# EAGLE board 8iPanelLED (EAGLE 6.6.0)
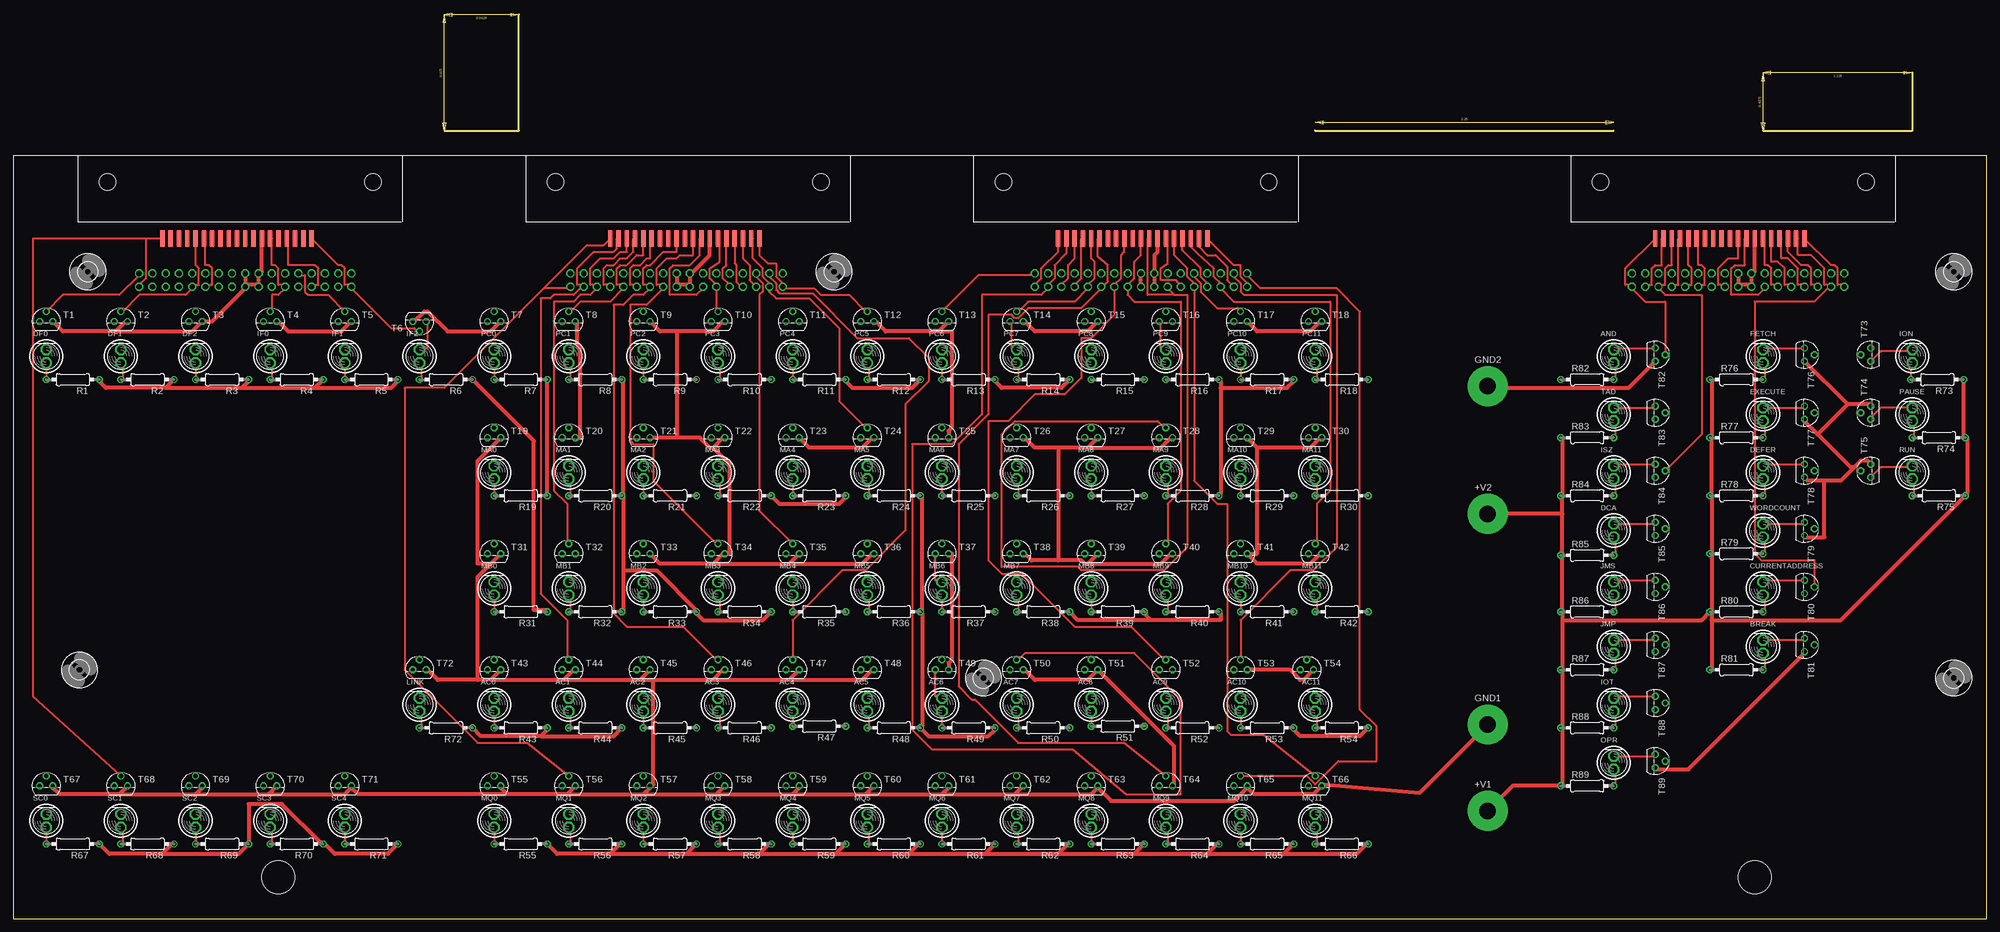
[diagram p2: board, top side]
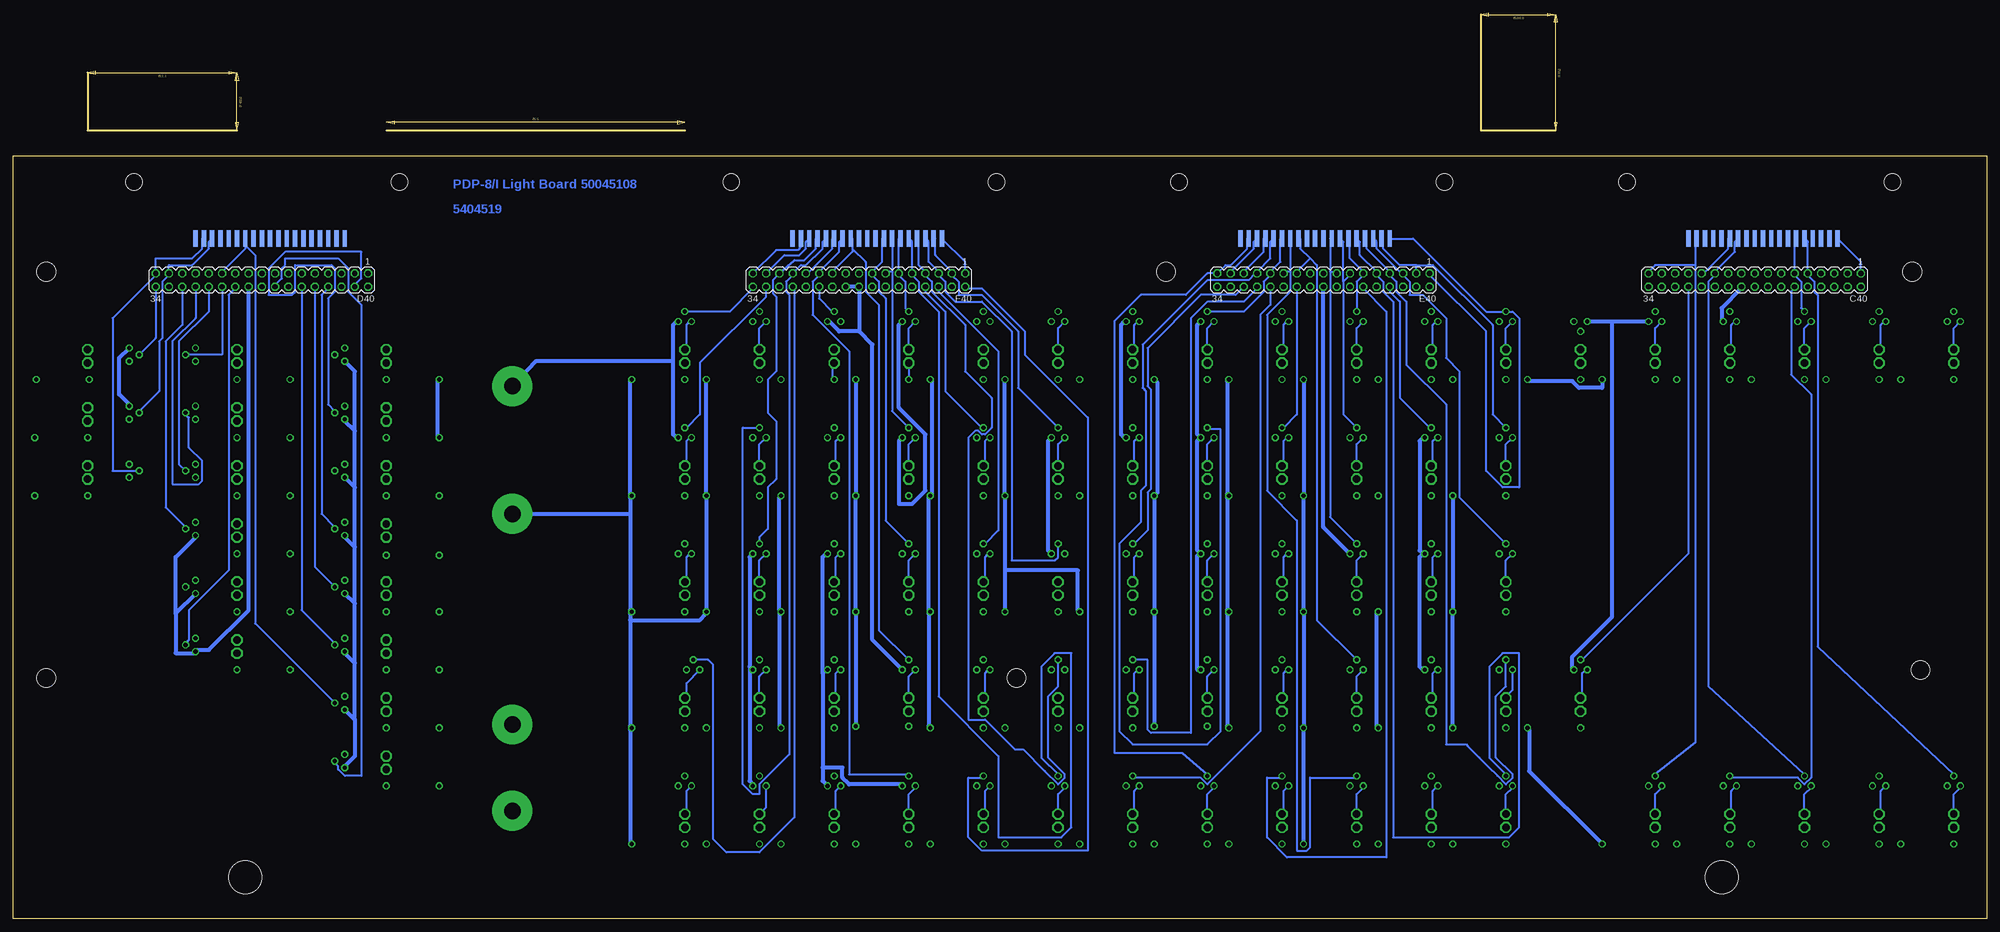
[diagram p3: board, bottom side, seen from below]

Size 377.82 x 173.04 mm. Coordinates in mm from the lower left corner, seen from the top.
Outline: 82.55,150.81 96.84,150.81 96.84,173.04
Outline: 334.96,150.81 363.54,150.81 363.54,161.93
Outline: 249.24,150.81 306.39,150.81
Outline: 0,0 377.82,0 377.82,146.05 0,146.05 0,0
Copper layers (1*16): Top 0.035mm / dielectric 1.5mm / Bottom 0.035mm
Design rules "15mils": minimum track width 15mil, minimum drill 24mil, track to track 15mil, track to pad 10mil, pad to pad 10mil, via to via 10mil, smd to smd 10mil, copper to edge 25mil, drill to drill 10mil, minimum pad ring 10mil, minimum via ring 8mil, stop-mask expansion 0mil, vias tented up to drill 0mil, thermal gap 10mil
Net classes: 1 supply: width 0.762 mm
Holes 6.35 mm at 50.8,7.94 333.38,7.94

## Footprints (pad centres in the part's own frame; a part is rotated, then mirrored left to right if it is on the bottom)
SPADELUG = drill 3.175 pad 7.62: 1 0,0
BULB = drill 1.422 octagon: A 0,0; B 0,2.54
MA17-2 = drill 1.016 octagon: 1 -20.32,-1.27; 2 -20.32,1.27; 3 -17.78,-1.27; 4 -17.78,1.27; 5 -15.24,-1.27; 6 -15.24,1.27; 7 -12.7,-1.27; 8 -12.7,1.27; 9 -10.16,-1.27; 10 -10.16,1.27; 11 -7.62,-1.27; 12 -7.62,1.27; 13 -5.08,-1.27; 14 -5.08,1.27; 15 -2.54,-1.27; 16 -2.54,1.27; 17 0,-1.27; 18 0,1.27; 19 2.54,-1.27; 20 2.54,1.27; 21 5.08,-1.27; 22 5.08,1.27; 23 7.62,-1.27; 24 7.62,1.27; 25 10.16,-1.27; 26 10.16,1.27; 27 12.7,-1.27; 28 12.7,1.27; 29 15.24,-1.27; 30 15.24,1.27; 31 17.78,-1.27; 32 17.78,1.27; 33 20.32,-1.27; 34 20.32,1.27
FLEX19 = smd 3.175 x 0.838: 1 0,14.287; 2 0,12.7; 3 0,11.113; 4 0,9.525; 5 0,7.938; 6 0,6.35; 7 0,4.763; 8 0,3.175; 9 0,1.587; 10 0,0; 11 0,-1.587; 12 0,-3.175; 13 0,-4.763; 14 0,-6.35; 15 0,-7.938; 16 0,-9.525; 17 0,-11.113; 18 0,-12.7; 19 0,-14.287
0207/10 = drill 0.813 octagon: 1 -5.08,0; 2 5.08,0
TO92 = drill 0.813 octagon: 1 1.27,0; 2 0,1.905; 3 -1.27,0
STRAIN-RELIEF = hole 3.175: 7.62,56.515; 7.62,5.715
3,6 = hole 3.6: 0,0

## Placement (x,y rotation side)
+V1  LUG  [SPADELUG]  282.26,20.64 0 top
+V2  LUG  [SPADELUG]  282.26,77.47 0 top
AC0  [BULB]  92.08,39.69 0 top
AC1  [BULB]  106.36,39.69 0 top
AC2  [BULB]  120.65,39.69 0 top
AC3  [BULB]  134.94,39.69 0 top
AC4  [BULB]  149.22,39.69 0 top
AC5  [BULB]  163.51,39.69 0 top
AC6  [BULB]  177.8,39.69 0 top
AC7  [BULB]  192.09,39.69 0 top
AC8  [BULB]  206.38,39.69 0 top
AC9  [BULB]  220.66,39.69 0 top
AC10  [BULB]  234.95,39.69 0 top
AC11  [BULB]  249.24,39.69 0 top
AND  [BULB]  306.39,106.36 0 top
BREAK  [BULB]  334.96,50.8 0 top
C40  [MA17-2]  44.45,122.24 180 bottom
C40BOT  FLEX19  [FLEX19]  42.86,130.18 90 top
C40TOP  FLEX19  [FLEX19]  42.86,130.18 270 bottom
CURRENTADDRESS  [BULB]  334.96,61.91 0 top
D40  [MA17-2]  330.2,122.24 180 bottom
D40BOT  FLEX19  [FLEX19]  128.59,130.18 90 top
D40TOP  FLEX19  [FLEX19]  128.59,130.18 270 bottom
DCA  [BULB]  306.39,73.03 0 top
DEFER  [BULB]  334.96,84.14 0 top
DF0  [BULB]  6.35,106.36 0 top
DF1  [BULB]  20.64,106.36 0 top
DF2  [BULB]  34.92,106.36 0 top
E40  [MA17-2]  127,122.24 180 bottom
E40BOT  FLEX19  [FLEX19]  214.31,130.18 90 top
E40TOP  FLEX19  [FLEX19]  214.31,130.18 270 bottom
EXECUTE  [BULB]  334.96,95.25 0 top
F40  [MA17-2]  215.9,122.24 180 bottom
F40BOT  FLEX19  [FLEX19]  328.61,130.18 90 top
F40TOP  FLEX19  [FLEX19]  328.61,130.18 270 bottom
FETCH  [BULB]  334.96,106.36 0 top
GND1  LUG  [SPADELUG]  282.26,37.15 0 top
GND2  LUG  [SPADELUG]  282.26,101.92 0 top
IF0  [BULB]  49.21,106.36 0 top
IF1  [BULB]  63.5,106.36 0 top
IF2  [BULB]  77.79,106.36 0 top
ION  [BULB]  363.54,106.36 0 top
IOT  [BULB]  306.39,39.69 0 top
ISZ  [BULB]  306.39,84.14 0 top
JMP  [BULB]  306.39,50.8 0 top
JMS  [BULB]  306.39,61.91 0 top
LINK  [BULB]  77.79,39.69 0 top
MA0  [BULB]  92.08,84.14 0 top
MA1  [BULB]  106.36,84.14 0 top
MA2  [BULB]  120.65,84.14 0 top
MA3  [BULB]  134.94,84.14 0 top
MA4  [BULB]  149.22,84.14 0 top
MA5  [BULB]  163.51,84.14 0 top
MA6  [BULB]  177.8,84.14 0 top
MA7  [BULB]  192.09,84.14 0 top
MA8  [BULB]  206.38,84.14 0 top
MA9  [BULB]  220.66,84.14 0 top
MA10  [BULB]  234.95,84.14 0 top
MA11  [BULB]  249.24,84.14 0 top
MB0  [BULB]  92.08,61.91 0 top
MB1  [BULB]  106.36,61.91 0 top
MB2  [BULB]  120.65,61.91 0 top
MB3  [BULB]  134.94,61.91 0 top
MB4  [BULB]  149.22,61.91 0 top
MB5  [BULB]  163.51,61.91 0 top
MB6  [BULB]  177.8,61.91 0 top
MB7  [BULB]  192.09,61.91 0 top
MB8  [BULB]  206.38,61.91 0 top
MB9  [BULB]  220.66,61.91 0 top
MB10  [BULB]  234.95,61.91 0 top
MB11  [BULB]  249.24,61.91 0 top
MQ0  [BULB]  92.08,17.46 0 top
MQ1  [BULB]  106.36,17.46 0 top
MQ2  [BULB]  120.65,17.46 0 top
MQ3  [BULB]  134.94,17.46 0 top
MQ4  [BULB]  149.22,17.46 0 top
MQ5  [BULB]  163.51,17.46 0 top
MQ6  [BULB]  177.8,17.46 0 top
MQ7  [BULB]  192.09,17.46 0 top
MQ8  [BULB]  206.38,17.46 0 top
MQ9  [BULB]  220.66,17.46 0 top
MQ10  [BULB]  234.95,17.46 0 top
MQ11  [BULB]  249.24,17.46 0 top
OPR  [BULB]  306.39,28.57 0 top
PAUSE  [BULB]  363.54,95.25 0 top
PC0  [BULB]  92.08,106.36 0 top
PC1  [BULB]  106.36,106.36 0 top
PC2  [BULB]  120.65,106.36 0 top
PC3  [BULB]  134.94,106.36 0 top
PC4  [BULB]  149.22,106.36 0 top
PC5  [BULB]  163.51,106.36 0 top
PC6  [BULB]  177.8,106.36 0 top
PC7  [BULB]  192.09,106.36 0 top
PC8  [BULB]  206.38,106.36 0 top
PC9  [BULB]  220.66,106.36 0 top
PC10  [BULB]  234.95,106.36 0 top
PC11  [BULB]  249.24,106.36 0 top
R1  1.5K  [0207/10]  11.43,103.19 180 top
R2  1.5K  [0207/10]  25.72,103.19 180 top
R3  1.5K  [0207/10]  40.01,103.19 180 top
R4  1.5K  [0207/10]  54.29,103.19 180 top
R5  1.5K  [0207/10]  68.58,103.19 180 top
R6  1.5K  [0207/10]  82.87,103.19 180 top
R7  1.5K  [0207/10]  97.16,103.19 180 top
R8  1.5K  [0207/10]  111.44,103.19 180 top
R9  1.5K  [0207/10]  125.73,103.19 180 top
R10  1.5K  [0207/10]  140.02,103.19 180 top
R11  1.5K  [0207/10]  154.31,103.19 180 top
R12  1.5K  [0207/10]  168.59,103.19 180 top
R13  1.5K  [0207/10]  182.88,103.19 180 top
R14  1.5K  [0207/10]  197.17,103.19 180 top
R15  1.5K  [0207/10]  211.46,103.19 180 top
R16  1.5K  [0207/10]  225.74,103.19 180 top
R17  1.5K  [0207/10]  240.03,103.19 180 top
R18  1.5K  [0207/10]  254.32,103.19 180 top
R19  1.5K  [0207/10]  97.16,80.96 180 top
R20  1.5K  [0207/10]  111.44,80.96 180 top
R21  1.5K  [0207/10]  125.73,80.96 180 top
R22  1.5K  [0207/10]  140.02,80.96 180 top
R23  1.5K  [0207/10]  154.31,80.96 180 top
R24  1.5K  [0207/10]  168.59,80.96 180 top
R25  1.5K  [0207/10]  182.88,80.96 180 top
R26  1.5K  [0207/10]  197.17,80.96 180 top
R27  1.5K  [0207/10]  211.46,80.96 180 top
R28  1.5K  [0207/10]  225.74,80.96 180 top
R29  1.5K  [0207/10]  240.03,80.96 180 top
R30  1.5K  [0207/10]  254.32,80.96 180 top
R31  1.5K  [0207/10]  97.16,58.74 180 top
R32  1.5K  [0207/10]  111.44,58.74 180 top
R33  1.5K  [0207/10]  125.73,58.74 180 top
R34  1.5K  [0207/10]  140.02,58.74 180 top
R35  1.5K  [0207/10]  154.31,58.74 180 top
R36  1.5K  [0207/10]  168.59,58.74 180 top
R37  1.5K  [0207/10]  182.88,58.74 180 top
R38  1.5K  [0207/10]  197.17,58.74 180 top
R39  1.5K  [0207/10]  211.46,58.74 180 top
R40  1.5K  [0207/10]  225.74,58.74 180 top
R41  1.5K  [0207/10]  240.03,58.74 180 top
R42  1.5K  [0207/10]  254.32,58.74 180 top
R43  1.5K  [0207/10]  97.16,36.51 180 top
R44  1.5K  [0207/10]  111.44,36.51 180 top
R45  1.5K  [0207/10]  125.73,36.51 180 top
R46  1.5K  [0207/10]  140.02,36.51 180 top
R47  1.5K  [0207/10]  154.31,36.83 180 top
R48  1.5K  [0207/10]  168.59,36.51 180 top
R49  1.5K  [0207/10]  182.88,36.51 180 top
R50  1.5K  [0207/10]  197.17,36.51 180 top
R51  1.5K  [0207/10]  211.46,36.83 180 top
R52  1.5K  [0207/10]  225.74,36.51 180 top
R53  1.5K  [0207/10]  240.03,36.51 180 top
R54  1.5K  [0207/10]  254.32,36.51 180 top
R55  1.5K  [0207/10]  97.16,14.29 180 top
R56  1.5K  [0207/10]  111.44,14.29 180 top
R57  1.5K  [0207/10]  125.73,14.29 180 top
R58  1.5K  [0207/10]  140.02,14.29 180 top
R59  1.5K  [0207/10]  154.31,14.29 180 top
R60  1.5K  [0207/10]  168.59,14.29 180 top
R61  1.5K  [0207/10]  182.88,14.29 180 top
R62  1.5K  [0207/10]  197.17,14.29 180 top
R63  1.5K  [0207/10]  211.46,14.29 180 top
R64  1.5K  [0207/10]  225.74,14.29 180 top
R65  1.5K  [0207/10]  240.03,14.29 180 top
R66  1.5K  [0207/10]  254.32,14.29 180 top
R67  1.5K  [0207/10]  11.43,14.29 180 top
R68  1.5K  [0207/10]  25.72,14.29 180 top
R69  1.5K  [0207/10]  40.01,14.29 180 top
R70  1.5K  [0207/10]  54.29,14.29 180 top
R71  1.5K  [0207/10]  68.58,14.29 180 top
R72  1.5K  [0207/10]  82.87,36.51 180 top
R73  1.5K  [0207/10]  368.3,103.19 180 top
R74  1.5K  [0207/10]  368.62,92.08 180 top
R75  1.5K  [0207/10]  368.62,80.96 180 top
R76  1.5K  [0207/10]  329.88,103.19 0 top
R77  1.5K  [0207/10]  329.88,92.08 0 top
R78  1.5K  [0207/10]  329.88,80.96 0 top
R79  1.5K  [0207/10]  329.88,69.85 0 top
R80  1.5K  [0207/10]  329.88,58.74 0 top
R81  1.5K  [0207/10]  329.88,47.62 0 top
R82  1.5K  [0207/10]  301.31,103.19 0 top
R83  1.5K  [0207/10]  301.31,92.08 0 top
R84  1.5K  [0207/10]  301.31,80.96 0 top
R85  1.5K  [0207/10]  301.31,69.53 0 top
R86  1.5K  [0207/10]  301.31,58.74 0 top
R87  1.5K  [0207/10]  301.31,47.62 0 top
R88  1.5K  [0207/10]  301.31,36.51 0 top
R89  1.5K  [0207/10]  301.31,25.4 0 top
RUN  [BULB]  363.54,84.14 0 top
SC0  [BULB]  6.35,17.46 0 top
SC1  [BULB]  20.64,17.46 0 top
SC2  [BULB]  34.92,17.46 0 top
SC3  [BULB]  49.21,17.46 0 top
SC4  [BULB]  63.5,17.46 0 top
T1  2N2222  [TO92]  6.35,114.3 0 top
T2  2N2222  [TO92]  20.64,114.3 0 top
T3  2N2222  [TO92]  34.92,114.3 0 top
T4  2N2222  [TO92]  49.21,114.3 0 top
T5  2N2222  [TO92]  63.5,114.3 0 top
T6  2N2222  [TO92]  77.79,114.3 180 top
T7  2N2222  [TO92]  92.08,114.3 0 top
T8  2N2222  [TO92]  106.36,114.3 0 top
T9  2N2222  [TO92]  120.65,114.3 0 top
T10  2N2222  [TO92]  134.94,114.3 0 top
T11  2N2222  [TO92]  149.22,114.3 0 top
T12  2N2222  [TO92]  163.51,114.3 0 top
T13  2N2222  [TO92]  177.8,114.3 0 top
T14  2N2222  [TO92]  192.09,114.3 0 top
T15  2N2222  [TO92]  206.38,114.3 0 top
T16  2N2222  [TO92]  220.66,114.3 0 top
T17  2N2222  [TO92]  234.95,114.3 0 top
T18  2N2222  [TO92]  249.24,114.3 0 top
T19  2N2222  [TO92]  92.08,92.08 0 top
T20  2N2222  [TO92]  106.36,92.08 0 top
T21  2N2222  [TO92]  120.65,92.08 0 top
T22  2N2222  [TO92]  134.94,92.08 0 top
T23  2N2222  [TO92]  149.22,92.08 0 top
T24  2N2222  [TO92]  163.51,92.08 0 top
T25  2N2222  [TO92]  177.8,92.08 0 top
T26  2N2222  [TO92]  192.09,92.08 0 top
T27  2N2222  [TO92]  206.38,92.08 0 top
T28  2N2222  [TO92]  220.66,92.08 0 top
T29  2N2222  [TO92]  234.95,92.08 0 top
T30  2N2222  [TO92]  249.24,92.08 0 top
T31  2N2222  [TO92]  92.08,69.85 0 top
T32  2N2222  [TO92]  106.36,69.85 0 top
T33  2N2222  [TO92]  120.65,69.85 0 top
T34  2N2222  [TO92]  134.94,69.85 0 top
T35  2N2222  [TO92]  149.22,69.85 0 top
T36  2N2222  [TO92]  163.51,69.85 0 top
T37  2N2222  [TO92]  177.8,69.85 0 top
T38  2N2222  [TO92]  192.09,69.85 0 top
T39  2N2222  [TO92]  206.38,69.85 0 top
T40  2N2222  [TO92]  220.66,69.85 0 top
T41  2N2222  [TO92]  234.95,69.85 0 top
T42  2N2222  [TO92]  249.24,69.85 0 top
T43  2N2222  [TO92]  92.08,47.62 0 top
T44  2N2222  [TO92]  106.36,47.62 0 top
T45  2N2222  [TO92]  120.65,47.62 0 top
T46  2N2222  [TO92]  134.94,47.62 0 top
T47  2N2222  [TO92]  149.22,47.62 0 top
T48  2N2222  [TO92]  163.51,47.62 0 top
T49  2N2222  [TO92]  177.8,47.62 0 top
T50  2N2222  [TO92]  192.09,47.62 0 top
T51  2N2222  [TO92]  206.38,47.62 0 top
T52  2N2222  [TO92]  220.66,47.62 0 top
T53  2N2222  [TO92]  234.95,47.62 0 top
T54  2N2222  [TO92]  247.65,47.62 0 top
T55  2N2222  [TO92]  92.08,25.4 0 top
T56  2N2222  [TO92]  106.36,25.4 0 top
T57  2N2222  [TO92]  120.65,25.4 0 top
T58  2N2222  [TO92]  134.94,25.4 0 top
T59  2N2222  [TO92]  149.22,25.4 0 top
T60  2N2222  [TO92]  163.51,25.4 0 top
T61  2N2222  [TO92]  177.8,25.4 0 top
T62  2N2222  [TO92]  192.09,25.4 0 top
T63  2N2222  [TO92]  206.38,25.4 0 top
T64  2N2222  [TO92]  220.66,25.4 0 top
T65  2N2222  [TO92]  234.95,25.4 0 top
T66  2N2222  [TO92]  249.24,25.4 0 top
T67  2N2222  [TO92]  6.35,25.4 0 top
T68  2N2222  [TO92]  20.64,25.4 0 top
T69  2N2222  [TO92]  34.92,25.4 0 top
T70  2N2222  [TO92]  49.21,25.4 0 top
T71  2N2222  [TO92]  63.5,25.4 0 top
T72  2N2222  [TO92]  77.79,47.62 0 top
T73  2N2222  [TO92]  355.6,107.95 90 top
T74  2N2222  [TO92]  355.6,96.84 90 top
T75  2N2222  [TO92]  355.6,85.72 90 top
T76  2N2222  [TO92]  342.9,107.95 270 top
T77  2N2222  [TO92]  342.9,96.84 270 top
T78  2N2222  [TO92]  342.9,85.72 270 top
T79  2N2222  [TO92]  342.9,74.61 270 top
T80  2N2222  [TO92]  342.9,63.5 270 top
T81  2N2222  [TO92]  342.9,52.39 270 top
T82  2N2222  [TO92]  314.32,107.95 270 top
T83  2N2222  [TO92]  314.32,96.84 270 top
T84  2N2222  [TO92]  314.32,85.72 270 top
T85  2N2222  [TO92]  314.32,74.61 270 top
T86  2N2222  [TO92]  314.32,63.5 270 top
T87  2N2222  [TO92]  314.32,52.39 270 top
T88  2N2222  [TO92]  314.32,41.27 270 top
T89  2N2222  [TO92]  314.32,30.16 270 top
TAD  [BULB]  306.39,95.25 0 top
U$1  [STRAIN-RELIEF]  74.61,133.35 90 top
U$2  [STRAIN-RELIEF]  160.34,133.35 90 top
U$3  [STRAIN-RELIEF]  246.06,133.35 90 top
U$4  [STRAIN-RELIEF]  360.36,133.35 90 top
U$5  [3,6]  371.48,123.83 0 top
U$6  [3,6]  371.48,46.04 0 top
U$7  [3,6]  185.74,46.04 0 top
U$8  [3,6]  12.7,47.62 0 top
U$9  [3,6]  14.29,123.83 0 top
U$11  [3,6]  157.16,123.83 0 top
WORDCOUNT  [BULB]  334.96,73.03 0 top

## Tracks (layer width: path | path; a pad name or v marks a point on that pad's centre or on a via)
+15V
  Top 0.762: 159.38,81.28 R23.1 159.38,80.64 158.12,79.38 146.69,79.38 R22.1 | R12.1 172.09,101.6 160.66,101.6 159.38,102.87 R11.1 | 116.84,66.67 116.84,80.64 R20.1 116.84,81.28 116.84,102.87 R8.1 | 116.84,66.67 116.84,59.05 R32.1 | 116.84,66.67 123.19,66.67 130.81,59.05 R33.1 130.81,58.42 132.08,57.15 143.51,57.15 R34.1 | 29.21,101.6 17.78,101.6 16.51,102.87 R1.1 | R2.1 29.21,101.6 | 43.81,101.6 45.09,102.87 R3.1 | 29.21,101.6 43.81,101.6 | 57.78,101.6 R4.1 | 43.81,101.6 57.78,101.6 | 57.78,101.6 72.39,101.6 73.66,102.87 R5.1 | R19.1 R7.1 | R67.1 18.41,12.38 28.57,12.38 | 28.57,12.38 30.48,14.29 R68.1 | 28.57,12.38 43.18,12.38 R69.1 45.09,21.91 51.44,21.91 59.05,14.29 R70.1 59.69,14.29 61.59,12.38 71.75,12.38 R71.1 | R72.1 89.53,34.92 100.97,34.92 | 100.97,34.92 102.23,36.2 R43.1 | R44.1 114.94,34.92 100.97,34.92 | R6.1 99.69,91.44 99.69,59.05 102.23,59.05 R31.1 | R55.1 104.14,12.38 114.3,12.38 | 114.3,12.38 116.2,14.29 R56.1 | 128.91,12.38 R57.1 | 114.3,12.38 128.91,12.38 | 142.88,12.38 144.78,14.29 R58.1 | 128.91,12.38 142.88,12.38 | 157.48,12.38 R59.1 | 142.88,12.38 157.48,12.38 | 171.45,12.38 173.35,14.29 R60.1 | 157.48,12.38 171.45,12.38 | 186.06,12.38 R61.1 | 171.45,12.38 186.06,12.38 | 200.03,12.38 201.93,14.29 R62.1 | 186.06,12.38 200.03,12.38 | 214.63,12.38 R63.1 | 200.03,12.38 214.63,12.38 | 228.6,12.38 230.5,14.29 R64.1 | 214.63,12.38 228.6,12.38 | 243.21,12.38 R65.1 | 228.6,12.38 243.21,12.38 | 243.21,12.38 257.18,12.38 259.08,14.29 R66.1 | 231.14,101.6 231.14,102.87 R16.1 | 231.14,101.6 231.14,81.28 R28.1 | 231.14,101.6 243.84,101.6 245.11,102.87 R17.1 | R54.1 257.81,34.92 246.38,34.92 245.11,36.2 R53.1 | R24.1 173.99,80.64 173.99,59.05 R36.1 173.99,58.42 173.99,36.83 R48.1 175.26,34.92 186.69,34.92 187.96,36.2 R49.1
  Top 0.762: R40.1 231.14,58.42 231.14,57.15 217.81,57.15 | 217.81,57.15 216.53,58.42 R39.1 | R38.1 203.84,57.15 217.81,57.15 | R14.1 200.66,101.6 189.23,101.6 187.96,102.87 R13.1 | R73.1 373.38,92.08 R74.1 374.01,92.08 374.01,81.28 R75.1 349.88,57.15 325.12,57.15 | 325.12,92.08 325.12,102.87 R76.1 | 325.12,57.15 325.12,58.42 R80.1 | 325.12,57.15 325.12,47.62 R81.1 | 325.12,69.85 325.12,80.64 R78.1 325.12,81.28 325.12,92.08 | 325.12,69.85 325.12,59.05 R80.1 | 325.12,69.85 R79.1 | 325.12,92.08 R77.1 | R83.1 296.55,92.08 296.55,81.28 R84.1 296.55,80.64 296.55,77.47 | 296.55,57.15 296.55,58.42 R86.1 296.55,59.05 296.55,69.22 R85.1 296.55,69.85 296.55,77.47 | 296.55,57.15 296.55,47.62 | 296.55,47.62 296.55,36.83 R88.1 296.55,36.2 296.55,25.4 R89.1 287.02,25.4 +V1.1 | 296.55,47.62 R87.1 | 296.55,77.47 +V2.1 | R80.1 323.21,57.15 296.55,57.15
  Bottom 0.762: R46.1 145.41,36.83 145.41,58.42 R34.1 145.41,59.05 145.41,80.64 R22.1 145.41,81.28 145.41,102.87 R10.1 | R47.1 R35.1 R23.1 158.75,81.6 158.75,102.55 R11.1 | R9.1 R21.1 R33.1 R45.1 R57.1 | R5.1 73.66,101.6 78.11,101.6 79.38,102.87 87.63,102.87 R6.1 | R19.1 R31.1 R43.1 | R71.1 87.63,28.26 87.63,36.2 R72.1 | R32.1 116.84,58.42 116.84,36.83 R44.1 | 259.71,77.47 259.71,80.64 R30.1 259.71,81.28 259.71,102.87 R18.1 | 259.71,77.47 259.71,59.05 R42.1 259.71,58.42 259.71,57.15 | 259.71,57.15 259.71,36.83 R54.1 259.71,36.2 259.71,14.29 R66.1 | 259.71,57.15 246.38,57.15 245.11,58.42 R41.1 R29.1 R17.1 | 187.96,66.67 R25.1 R13.1 | 187.96,66.67 R37.1 | 187.96,66.67 173.99,66.67 173.99,59.05 R36.1 | R15.1 R27.1 R39.1 R51.1 | R14.1 201.93,102.87 201.93,81.28 R26.1 202.56,80.64 202.56,59.05 R38.1 202.56,58.42 202.56,36.83 R50.1 | 231.14,59.05 231.14,36.83 R52.1 | 231.14,59.05 231.14,80.64 R28.1 | 231.14,59.05 R40.1 | R82.1 296.55,102.87 296.55,92.08 R83.1 | +V2.1 259.71,77.47
AC0
  Bottom 0.381: T43.2 92.08,44.45 93.98,42.55 93.98,30.8 90.81,27.62 90.81,26.99 92.08,25.72 93.66,27.3 95.57,29.21 97.16,30.8 98.42,32.07 99.38,33.02 99.69,33.34 103.5,33.34 103.5,98.42 111.12,106.05 111.12,118.11 113.03,120.02 113.03,121.92 114.3,123.19 E40.7 114.3,123.83 118.75,128.27 118.75,130.18 D40TOP.4
AC1
  Top 0.381: T44.2 106.05,49.53 106.05,57.15 100.97,62.23 100.97,118.75 102.87,118.75 103.5,119.38 107.31,119.38 108.58,120.65 109.22,120.65 E40.4 109.22,121.28 107.95,121.28 107.95,124.46 111.12,127.64 114.94,127.64 115.57,128.27 115.57,130.18 D40BOT.2
AC2
  Bottom 0.381: T45.2 128.27,57.15 128.27,125.09 129.54,126.36 | 129.54,126.36 131.44,128.27 131.44,130.18 D40TOP.12 | 129.54,126.36 132.08,123.83 E40.21
AC3
  Top 0.381: T46.2 134.62,49.53 128.27,55.88 117.47,55.88 114.94,58.42 114.94,117.47 116.84,117.47 118.75,119.38 120.65,119.38 121.92,120.65 E40.14 121.92,121.28 120.65,121.28 120.65,124.46 121.28,125.09 121.92,125.09 124.46,127.64 127,127.64 D40BOT.9
AC4
  Top 0.381: E40.31 144.78,122.87 146.05,121.6 146.05,120.33 146.69,119.7 153.03,119.7 161.61,111.12 171.45,111.12 175.26,107.31 175.26,102.87 170.81,98.42 170.81,74.3 163.19,66.67 158.75,66.67 149.22,57.15 T47.2
  Bottom 0.381: D40TOP.17 140.34,129.54 140.34,128.27 144.78,123.83 E40.31
AC5
  Top 0.381: E40.28 139.38,120.97 138.43,121.92 138.43,125.09 138.11,125.41 D40BOT.16
  Bottom 0.381: T48.2 160.66,49.53 160.66,36.2 160.02,35.56 152.4,35.56 152.4,114.94 149.22,118.11 142.24,118.11 139.7,120.65 E40.28
AC6
  Bottom 0.381: T49.2 177.8,44.45 179.71,42.55 179.71,30.8 176.53,27.62 176.53,26.99 177.8,25.72 180.34,28.26 184.47,32.38 186.06,32.38 191.45,37.78 191.77,38.1 194.94,38.1 194.94,92.08 193.68,93.34 193.04,93.34 192.41,92.71 191.77,92.71 190.5,93.98 190.5,99.69 195.58,104.78 195.58,113.67 201.93,120.02 201.93,121.92 203.2,123.19 F40.7 203.2,123.83 204.47,125.09 204.47,130.18 E40TOP.4
AC7
  Top 0.381: T50.2 192.41,49.53 193.68,50.8 214.63,50.8 223.52,41.91 223.52,23.81 213.04,23.81 202.88,32.38 175.9,32.38 172.09,36.2 172.09,90.81 179.71,90.81 185.42,96.52 185.42,119.38 196.85,119.38 198.12,120.65 F40.4 198.12,121.28 199.39,122.56 199.39,125.09 201.61,127.32 E40BOT.2
AC8
  Bottom 0.381: T51.2 212.09,55.24 212.09,117.47 214.63,120.02 214.63,125.73 217.17,128.27 | 217.17,128.27 217.17,130.18 E40TOP.12 | 217.17,128.27 217.17,127.64 220.98,123.83 F40.21
AC9
  Top 0.381: T52.2 220.34,49.53 214,55.88 203.2,55.88 193.04,66.04 189.23,66.04 186.69,68.58 186.69,95.25 190.5,95.25 195.58,100.33 201.29,100.33 204.47,103.5 204.47,111.12 206.38,111.12 210.82,115.57 F40.14 210.82,121.28 212.09,122.56 212.09,127 212.72,127.64 E40BOT.9
AC10
  Top 0.381: T53.2 234.95,57.15 244.47,66.67 248.92,66.67 253.37,71.12 253.37,119.38 235.59,119.38 234.95,120.02 234.95,121.6 233.68,122.87 F40.31
  Bottom 0.381: E40TOP.17 226.06,129.54 226.06,128.27 227.33,127 230.19,127 F40.31
AC11
  Top 0.381: 223.84,130.49 E40BOT.16 223.84,127.95 227.33,124.46 227.33,122.87 228.6,121.6 F40.28
  Bottom 0.381: F40.28 228.28,120.65 228.28,19.37 234.95,12.7 241.3,12.7 243.84,15.24 243.84,48.58 244.79,49.53 T54.2
AND
  Top 0.381: T82.2 316.23,118.11 312.42,118.11 309.88,120.65 D40.2 309.88,121.28 308.61,121.28 308.61,124.46 F40BOT.1
BREAK
  Top 0.381: F40BOT.12 331.47,130.18 331.47,125.09 329.56,125.09 328.93,124.46 328.93,119.38 334.01,119.38 335.28,120.65 D40.22
  Bottom 0.381: T81.2 344.81,52.7 344.17,53.34 344.17,59.05 336.55,66.67 336.55,119.38 335.28,120.65 D40.22
CA
  Top 0.381: T80.2 344.81,68.58 334.64,68.58 333.38,69.85 333.38,118.11 344.81,118.11 347.35,120.65 347.98,120.65 D40.32 347.98,121.28 346.71,121.28 346.71,124.46 344.17,127 341.63,127 341.63,130.18 F40BOT.18
DCA
  Top 0.381: F40BOT.4 318.77,130.18 318.77,121.28 317.5,121.28 D40.8
  Bottom 0.381: T85.2 316.23,74.93 318.77,77.47 318.77,119.38 317.5,120.65 D40.8
DEFER
  Top 0.381: F40BOT.15 336.55,125.73 337.82,125.73 339.09,124.46 339.09,121.28 340.36,121.28 D40.26
  Bottom 0.381: T78.2 346.07,87 346.07,110.49 340.36,116.2 D40.26
DF0
  Top 0.381: T1.2 9.53,119.38 20.32,119.38 24.13,123.19 C40.1
  Bottom 0.381: C40TOP.1 24.13,125.73 C40.1
DF1
  Top 0.381: T2.2 20.95,116.2 24.13,119.38 33.02,119.38 34.29,120.65 C40.10 34.29,121.28 35.56,121.28 35.56,124.46 34.92,125.09 C40BOT.5
DF2
  Bottom 0.381: T3.2 35.56,116.84 35.56,121.92 36.83,123.19 C40.11 36.83,130.18 C40TOP.6
EXECUTE
  Top 0.381: F40BOT.16 338.45,130.18 338.45,126.36 339.73,126.36 341.63,124.46 341.63,121.28 342.9,121.28 D40.28
  Bottom 0.381: D40.28 342.9,114.94 347.35,110.49 347.35,83.19 342.26,83.19 341.63,83.82 341.63,87.63 344.17,90.17 344.17,95.89 344.81,96.52 T77.2
FETCH
  Top 0.381: F40BOT.14 335.28,130.18 335.28,125.09 335.92,125.09 336.55,124.46 336.55,121.28 337.82,121.28 D40.24
  Bottom 0.381: T76.2 337.82,107.95 D40.24
GND
  Top 0.762: T49.1 179.07,48.9 179.71,49.53 179.71,69.85 T37.1 | 177.16,112.39 167,112.39 165.1,114.3 T12.1 | T13.1 177.16,112.39 | T23.1 152.4,90.17 162.56,90.17 164.47,92.08 T24.1 | T25.1 179.07,93.34 179.71,93.98 179.71,112.39 177.16,112.39 | 127,92.08 131.44,92.08 133.35,90.17 133.99,90.17 | 127,92.08 T21.1 | 133.99,90.17 135.89,92.08 T22.1 | T9.1 123.83,112.39 127,112.39 | 127,112.39 133.99,112.39 135.89,114.3 T10.1 | 127,112.39 127,92.08 | E40.17 127,121.28 | 129.54,121.28 E40.19 129.54,123.83 130.18,123.83 133.35,127 D40BOT.13 | 129.54,121.28 127,121.28 | 127,121.28 E40.18 | 129.54,121.28 E40.20 | T33.1 123.83,67.94 133.99,67.94 | 133.99,67.94 135.89,69.85 T34.1 137.16,69.85 137.16,87 133.99,90.17 | 148.59,67.94 T35.1 | 133.99,67.94 148.59,67.94 | 148.59,67.94 162.56,67.94 164.47,69.85 T36.1 | T7.1 91.44,112.39 83.19,112.39 79.38,116.2 78.74,116.2 76.83,114.3 T6.1 | C40.17 44.45,121.28 | 46.99,121.28 C40.19 46.99,123.83 47.62,123.83 C40BOT.13 | 46.99,121.28 44.45,121.28 | 44.45,121.28 C40.18 44.45,120.65 38.1,114.3 T3.1 34.29,112.39 19.68,112.39 | 46.99,121.28 C40.20 | T1.1 9.53,112.39 19.68,112.39 | 19.68,112.39 21.59,114.3 T2.1 | T5.1 62.87,112.39 52.7,112.39 50.8,114.3 T4.1 | T20.1 108.58,92.08 108.58,109.22 107.95,109.86 107.95,114.3 T8.1 | 91.44,45.72 88.9,45.72 | 88.9,45.72 81.28,45.72 79.38,47.62 T72.1 | T43.1 91.44,45.72 | 105.41,45.72 107.31,47.62 T44.1 | 91.44,45.72 105.41,45.72 | 120.02,45.72 T45.1 | 105.41,45.72 120.02,45.72 | 133.99,45.72 135.89,47.62 T46.1 | 120.02,45.72 122.56,45.72 | 122.56,45.72 133.99,45.72 | 148.59,45.72 T47.1 | 133.99,45.72 148.59,45.72 | 148.59,45.72 162.56,45.72 164.47,47.62 T48.1
  Top 0.762: 91.44,67.94 88.9,65.41 88.9,45.72 | 91.44,67.94 T31.1 | T19.1 88.9,87.63 88.9,67.94 91.44,67.94 | T78.1 343.54,83.82 346.71,83.82 | 346.71,83.82 349.88,83.82 352.43,86.36 | 352.43,86.36 353.69,87.63 354.96,87.63 T75.1 | 345.44,92.71 351.79,86.36 352.43,86.36 | 345.44,92.71 342.9,95.25 T77.1 | 351.15,98.42 T76.1 | 351.15,98.42 355.6,98.42 T74.1 | 351.15,98.42 345.44,92.71 | D40.17 330.2,121.28 | 332.74,121.28 D40.19 332.74,123.83 333.38,123.83 F40BOT.13 | 332.74,121.28 330.2,121.28 | 330.2,121.28 D40.18 | 332.74,121.28 D40.20 | 346.71,83.82 346.71,73.03 342.9,73.03 T79.1 | T17.1 238.12,112.39 248.28,112.39 250.19,114.3 T18.1 | 238.12,90.17 T29.1 | 238.12,90.17 248.28,90.17 250.19,92.08 T30.1 | 236.22,25.08 237.49,23.81 248.92,23.81 T66.1 250.82,25.72 269.24,24.13 GND1.1 | T53.1 244.47,47.62 246.38,45.72 247.01,45.72 T54.1 | T42.1 250.19,69.85 248.28,67.94 238.12,67.94 T41.1 238.12,69.85 238.12,90.17 | T82.1 309.25,101.6 282.57,101.6 GND2.1 | T81.1 342.9,50.8 320.68,28.57 314.32,28.57 T89.1 | 200.03,68.58 204.47,68.58 205.1,67.94 205.74,67.94 | 200.03,68.58 194.94,68.58 193.68,69.85 T38.1 | T39.1 205.74,67.94 | 205.74,67.94 219.71,67.94 221.62,69.85 T40.1 | T15.1 205.74,112.39 195.58,112.39 193.68,114.3 T14.1 | 205.74,90.17 200.03,90.17 | 200.03,90.17 195.58,90.17 193.68,92.08 T26.1 | T27.1 205.74,90.17 | 205.74,90.17 219.71,90.17 221.62,92.08 T28.1 | 200.03,90.17 200.03,68.58 | F40.20 F40.19 218.44,127 219.07,127.64 E40BOT.13 | F40.18 F40.17 | T50.1 193.68,47.62 195.58,45.72 205.74,45.72 T51.1 222.25,33.02 222.25,25.72 T64.1 | 20.32,23.81 8.89,23.81 7.62,25.08 T67.1 | T68.1 20.32,23.81 | 34.92,23.81 36.2,25.08 T69.1
  Top 0.762: 20.32,23.81 34.92,23.81 | 48.9,23.81 T70.1 | 34.92,23.81 48.9,23.81 | 64.77,25.08 63.5,23.81 48.9,23.81 | 94.61,23.81 93.34,25.08 T55.1 | 106.05,23.81 94.61,23.81 | T56.1 106.05,23.81 | 120.65,23.81 121.92,25.08 T57.1 121.92,25.72 122.56,25.72 122.56,45.72 | 106.05,23.81 120.65,23.81 | 134.62,23.81 T58.1 | 120.65,23.81 134.62,23.81 | 149.22,23.81 150.5,25.08 T59.1 | 134.62,23.81 149.22,23.81 | 163.19,23.81 T60.1 | 149.22,23.81 163.19,23.81 | 177.8,23.81 179.07,25.08 T61.1 | 163.19,23.81 177.8,23.81 | 191.77,23.81 T62.1 | 177.8,23.81 191.77,23.81 | 207.65,25.08 206.38,23.81 191.77,23.81 | 64.77,25.08 66.04,23.81 94.61,23.81 | 64.77,25.08 T71.1 | 236.22,25.08 233.68,22.54 210.19,22.54 207.65,25.08 | 236.22,25.08 T65.1 | 207.65,25.08 T63.1
  Bottom 0.762: T25.1 179.71,91.44 179.71,70.48 T37.1 | T11.1 151.13,113.67 151.13,92.71 T23.1 151.13,91.44 151.13,70.48 T35.1 150.81,69.85 151.13,69.53 151.13,47.62 T47.1 | T12.1 165.1,114.3 165.74,113.67 165.74,92.71 165.1,92.08 T24.1 | E40.18 127,74.93 T33.1 | T6.1 71.75,114.3 | 71.75,114.3 T5.1 | T4.1 50.8,114.3 50.8,116.84 46.99,120.65 C40.20 | 107.95,69.85 108.58,70.48 108.58,91.44 107.95,92.08 T20.1 | 107.95,69.85 108.58,69.22 108.58,48.26 107.95,47.62 T44.1 | 107.95,69.85 T32.1 | 71.75,114.3 71.75,57.78 79.38,50.16 79.38,47.62 T72.1 | T73.1 357.5,107.31 357.5,100.33 355.6,98.42 T74.1 | 346.71,58.42 346.71,50.8 342.9,50.8 T81.1 342.9,51.44 340.36,51.44 332.74,59.05 D40.20 | T80.1 346.71,58.42 | 346.71,58.42 346.71,69.22 342.9,73.03 T79.1 | 312.42,38.1 312.42,31.11 314.32,29.21 T89.1 | T88.1 312.42,38.1 | 312.42,48.9 314.32,50.8 T87.1 | 312.42,38.1 312.42,48.9 | 312.42,60.33 T86.1 | 312.42,48.9 312.42,60.33 | 312.42,71.12 314.32,73.03 T85.1 | 312.42,60.33 312.42,71.12 | 312.42,82.55 T84.1 | 312.42,71.12 312.42,82.55 | 312.42,93.34 314.32,95.25 T83.1 | 312.42,82.55 312.42,93.34 | T82.1 312.42,104.78 312.42,93.34 | 236.85,48.26 T53.1 | 236.85,48.26 236.85,69.22 T41.1 | 236.85,48.26 236.85,26.35 236.22,25.72 T65.1 | 251.46,106.68 251.46,92.71 250.82,92.08 T30.1 | 251.46,106.68 251.46,113.67 250.82,114.3 T18.1 | T15.1 208.28,113.67 208.28,97.79 203.2,92.71 203.2,81.92 205.74,79.38 208.28,79.38 208.28,91.44 T27.1 | 215.9,112.39 219.71,112.39 221.62,114.3 T16.1 | 215.9,112.39 F40.18 F40.20 | T64.1 222.88,26.35 222.88,28.89 | 222.88,46.99 222.88,28.89 | 222.88,46.99 222.25,47.62 T52.1 | 215.9,112.39 213.36,109.86 213.36,53.34 T51.1
  Bottom 0.762: 222.88,46.99 222.88,69.22 222.25,69.85 T40.1 | 222.88,28.89 219.07,28.89 219.07,26.99 217.81,25.72 207.65,25.72 T63.1 | GND2.1 277.81,106.68 251.46,106.68
IF0
  Top 0.381: T4.2 49.53,116.2 49.53,119.38 50.8,119.38 52.07,120.65 C40.24 52.07,121.28 50.8,121.28 50.8,124.46 50.16,125.09 49.53,125.09 49.53,130.18 C40BOT.14
IF1
  Top 0.381: T5.2 60.33,119.38 56.52,119.38 55.88,120.02 55.88,123.19 54.61,123.19 C40.25
  Bottom 0.381: C40TOP.14 49.53,130.18 49.53,128.27 54.61,123.19 C40.25
IF2
  Top 0.381: T6.2 77.47,112.39 76.83,113.03 72.39,113.03 64.77,120.65 C40.34 64.77,121.28 63.5,121.28 63.5,124.46 62.87,125.09 62.23,125.09 C40BOT.19
ION
  Top 0.381: F40BOT.19 347.98,125.09 348.62,125.09 349.25,124.46 349.25,121.28 350.52,121.28 D40.34
  Bottom 0.381: T73.2 350.52,111.12 D40.34
IOT
  Bottom 0.381: T88.2 331.47,56.52 331.47,127 333.38,128.91 | 333.38,128.91 333.38,128.27 337.82,123.83 D40.23 | 333.38,128.91 F40TOP.13
ISZ
  Top 0.381: T84.2 323.21,92.71 323.21,119.38 316.23,119.38 314.96,120.65 D40.6 314.96,121.28 316.23,121.28 316.23,124.46 316.87,125.09 317.5,125.09 F40BOT.3
JMP
  Top 0.381: F40BOT.6 322.58,130.18 322.58,125.09 323.21,125.09 323.85,124.46 323.85,121.28 322.58,121.28 D40.12
  Bottom 0.381: D40.12 322.58,59.05 316.23,52.7 T87.2
JMS
  Top 0.381: F40BOT.5 320.68,125.09 321.31,124.46 321.31,121.28 320.04,121.28 D40.10
  Bottom 0.381: T86.2 320.04,67.31 D40.10
LINK
  Top 0.381: C40BOT.16 52.7,130.18 52.7,125.09 57.78,125.09 58.42,124.46 58.42,121.28 57.15,121.28 C40.28
  Bottom 0.381: C40.28 57.15,69.85 77.47,49.53 T72.2
MA0
  Bottom 0.381: T19.2 94.61,96.52 94.61,113.67 106.05,125.09 109.22,125.09 | E40.3 109.22,125.09 | 109.22,125.09 112.39,125.09 115.57,128.27 115.57,130.18 D40TOP.2
MA1
  Top 0.381: D40BOT.4 118.75,130.18 118.75,127.64 117.47,126.36 116.2,126.36 114.94,125.09 113.67,125.09 113.03,124.46 113.03,121.28 114.3,121.28 E40.8
  Bottom 0.381: E40.8 114.3,120.02 112.39,118.11 112.39,99.69 106.68,93.98 T20.2
MA2
  Bottom 0.381: T21.2 123.19,96.52 123.19,121.92 | 123.19,121.92 121.92,123.19 E40.13 | D40TOP.7 123.19,129.54 123.19,121.92
MA3
  Top 0.381: D40BOT.12 131.44,130.18 131.44,127 129.54,125.09 126.36,125.09 125.73,124.46 125.73,119.38 130.81,119.38 132.08,120.65 E40.22
  Bottom 0.381: E40.22 132.08,96.52 134.62,93.98 T22.2
MA4
  Bottom 0.381: D40TOP.15 137.16,129.54 137.16,126.36 139.7,123.83 E40.27 140.02,123.51 141.29,122.24 149.22,122.24 161.61,109.86 161.61,101.6 160.97,100.97 160.97,82.87 161.93,81.92 161.93,75.88 166.05,71.75 166.05,35.88 163.51,33.34 149.22,33.34 146.69,35.88 146.69,93.66 148.91,93.66 T23.2
MA5
  Top 0.381: D40BOT.18 141.6,130.18 141.6,126.36 143.51,124.46 143.51,122.87 144.78,121.6 E40.32 144.78,120.02 146.05,118.75 152.4,118.75 158.12,113.03 158.12,99.06 163.19,93.98 T24.2
MA6
  Bottom 0.381: T25.2 185.42,101.6 185.42,112.39 192.41,119.38 196.85,119.38 196.85,121.92 198.12,123.19 F40.3 198.12,123.83 201.29,127 201.29,130.18 E40TOP.2
MA7
  Top 0.381: E40BOT.4 204.47,130.18 204.47,122.56 203.2,121.28 F40.8
  Bottom 0.381: F40.8 203.2,120.02 199.39,116.2 199.39,100.97 192.41,93.98 T26.2
MA8
  Bottom 0.381: T27.2 209.55,97.16 209.55,123.83 | E40TOP.7 209.55,123.83 | 209.55,123.83 210.82,123.83 F40.13
MA9
  Top 0.381: 222.25,119.38 224.79,119.38 224.79,71.12 220.34,66.67 204.47,66.67 203.84,67.31 189.23,67.31 189.23,92.71 191.77,95.25 219.07,95.25 220.34,93.98 T28.2 | 222.25,119.38 220.98,120.65 F40.22 | 222.25,119.38 217.17,119.38 217.17,130.18 E40BOT.12
MA10
  Bottom 0.381: T29.2 238.12,93.98 238.12,25.72 236.22,23.81 234.95,23.81 234.95,25.72 229.24,31.43 229.24,119.38 229.87,120.02 229.87,121.92 228.6,123.19 F40.27 227.01,125.09 226.06,125.09 222.88,128.27 222.88,129.54 E40TOP.15
MA11
  Top 0.381: E40BOT.18 227.01,128.59 228.6,127 230.19,127 232.41,124.78 232.41,122.24 F40.32
  Bottom 0.381: T30.2 248.92,93.98 246.38,96.52 246.38,106.36 233.68,119.06 F40.32
MB0
  Bottom 0.381: T31.2 100.97,80.64 100.97,104.78 103.5,107.31 103.5,114.94 107.95,119.38 110.49,119.38 110.49,121.92 111.76,123.19 | D40TOP.3 116.84,129.54 116.84,128.27 111.76,123.19 | 111.76,123.19 E40.5
MB1
  Top 0.381: T32.2 106.05,71.75 106.05,79.38 103.5,81.92 103.5,118.11 107.31,118.11 108.58,119.38 110.49,119.38 111.76,120.65 E40.6 111.76,121.28 110.49,121.28 110.49,124.46 112.39,126.36 114.94,126.36 116.2,127.64 117.47,127.64 D40BOT.3
MB2
  Bottom 0.381: T33.2 125.73,76.83 125.73,123.83 | 125.73,123.83 125.73,130.18 D40TOP.8 | 125.73,123.83 124.46,123.83 E40.15
MB3
  Top 0.381: T34.2 134.62,71.75 122.56,83.82 122.56,90.81 118.75,90.81 118.11,91.44 118.11,117.47 121.28,117.47 124.46,120.65 E40.16 124.46,121.28 123.19,121.28 123.19,124.46 125.09,126.36 127,126.36 127.64,127 130.18,127 D40BOT.11
MB4
  Top 0.381: E40.29 142.24,122.87 143.51,121.6 143.51,120.02 142.88,119.38 142.88,78.11 T35.2
  Bottom 0.381: D40TOP.16 138.43,130.18 138.43,127.64 142.24,123.83 E40.29
MB5
  Top 0.381: D40BOT.17 139.7,126.36 140.97,125.09 140.97,122.24 E40.30
  Bottom 0.381: E40.30 143.83,119.38 150.5,119.38 160.66,109.22 160.66,101.92 160.02,101.28 160.02,82.23 160.66,81.6 160.66,74.3 163.19,71.75 T36.2
MB6
  Bottom 0.381: T37.2 177.8,69.22 178.44,68.58 186.69,68.58 186.69,112.39 192.41,118.11 197.49,118.11 199.39,120.02 199.39,121.92 200.66,123.19 F40.5 200.66,123.83 202.56,125.73 202.56,129.54 E40TOP.3
MB7
  Top 0.381: E40BOT.3 203.2,126.36 201.93,125.09 201.93,122.56 200.66,121.28 F40.6
  Bottom 0.381: F40.6 200.66,120.02 189.23,108.58 189.23,74.3 191.77,71.75 T38.2
MB8
  Bottom 0.381: T39.2 210.82,76.2 210.82,118.75 212.09,120.02 212.09,121.92 213.36,123.19 F40.15 213.36,123.83 211.46,125.73 211.46,130.18 E40TOP.8
MB9
  Top 0.381: T40.2 220.98,71.75 220.98,79.38 223.52,81.92 223.52,118.11 214.63,118.11 213.36,119.38 F40.16 213.36,121.28 214.63,122.56 214.63,125.73 215.9,127 E40BOT.11
MB10
  Bottom 0.381: E40TOP.16 224.16,130.18 224.16,128.27 226.38,126.05 228.28,126.05 F40.29 232.41,122.24 232.41,119.7 231.78,119.06 231.78,104.78 233.36,103.19 233.36,96.84 231.78,95.25 231.78,84.14 233.36,82.55 233.36,74.61 234.95,73.03 T41.2
MB11
  Top 0.381: T42.2 249.56,71.75 249.56,79.38 252.09,81.92 252.09,118.11 233.68,118.11 231.14,120.65 F40.30 231.14,121.6 229.87,122.87 229.87,124.46 226.69,127.32 225.43,128.59 E40BOT.17
MQ0
  Bottom 0.381: T55.2 92.08,27.62 95.25,30.8 95.25,48.26 92.71,50.8 89.53,50.8 89.53,17.46 91.44,15.56 113.67,15.56 113.67,118.11 115.57,120.02 115.57,121.92 116.84,123.19 E40.9 116.84,123.83 120.02,127 120.02,129.54 D40TOP.5
MQ1
  Top 0.381: T56.2 98.42,33.66 88.9,33.66 74.93,47.62 74.93,101.6 82.55,101.6 101.6,120.65 | 101.6,120.65 106.68,120.65 E40.2 | D40BOT.1 113.03,128.91 109.86,128.91 101.6,120.65
MQ2
  Bottom 0.381: D40TOP.13 133.35,123.83 | 133.35,123.83 133.35,120.02 137.79,115.57 137.79,81.92 132.08,76.2 132.08,13.02 130.18,13.02 129.54,13.65 129.54,26.99 120.65,26.99 T57.2 | 133.35,123.83 134.62,123.83 E40.23
MQ3
  Top 0.381: D40BOT.6 121.92,130.18 121.92,126.36 121.28,126.36 120.02,125.09 118.75,125.09 118.11,124.46 118.11,121.28 119.38,121.28 E40.12
  Bottom 0.381: T58.2 135.25,26.99 137.79,26.99 137.79,15.56 133.99,11.75 114.94,11.75 114.94,116.2 119.38,120.65 E40.12
MQ4
  Bottom 0.381: D40TOP.18 141.6,130.18 141.6,128.27 144.78,125.09 145.73,125.09 E40.33 149.22,123.51 153.35,119.38 161.93,119.38 167,114.3 167,31.75 153.99,31.75 149.22,27.62 T59.2
MQ5
  Top 0.381: D40BOT.15 136.53,125.09 135.89,124.46 135.89,122.56 137.16,121.28 E40.26
  Bottom 0.381: E40.26 137.16,117.47 139.06,115.57 139.06,35.88 149.22,25.72 150.5,26.99 163.19,26.99 T60.2
MQ6
  Bottom 0.381: T61.2 177.8,27.62 180.97,30.8 180.97,48.26 178.44,50.8 175.26,50.8 175.26,17.46 177.16,15.56 189.23,15.56 189.23,31.11 200.66,42.55 200.66,116.2 204.47,120.02 204.47,121.92 205.74,123.19 F40.9 205.74,129.54 E40TOP.5
MQ7
  Top 0.381: E40BOT.1 200.03,127.64 196.85,124.46 196.85,122.56 195.58,121.28 F40.2
  Bottom 0.381: T62.2 192.41,26.99 194.94,26.99 194.94,15.56 192.41,13.02 172.09,13.02 172.09,95.89 184.15,107.95 184.15,112.39 192.41,120.65 195.58,120.65 F40.2
MQ8
  Bottom 0.381: T63.2 206.38,27.62 217.81,27.62 217.81,108.58 224.79,115.57 224.79,121.92 223.52,123.19 F40.23 223.52,123.83 219.71,127.64 219.71,129.54 E40TOP.13
MQ9
  Top 0.381: T64.2 212.72,33.66 192.41,33.66 184.15,41.91 183.51,41.91 180.97,44.45 180.97,90.81 186.69,96.52 186.69,115.57 191.13,115.57 191.77,114.94 192.41,114.94 194.31,116.84 204.47,116.84 208.28,120.65 F40.12 209.55,121.92 209.55,125.09 207.65,126.68 207.65,130.18 E40BOT.6
MQ10
  Top 0.381: T65.2 247.65,27.3 249.24,25.72 253.68,30.16 260.99,30.16 260.99,36.83 257.81,40.01 257.81,116.2 253.37,120.65 238.76,120.65 236.22,123.19 F40.33
  Bottom 0.381: E40TOP.18 227.01,128.59 227.65,127.95 231.78,127.95 F40.33
MQ11
  Top 0.381: T66.2 239.4,35.24 233.04,35.24 232.41,35.88 232.41,79.38 230.5,79.38 226.06,83.82 F40.26 226.06,121.6 224.79,122.87 224.79,124.46 222.25,127 E40BOT.15
N$1
  Bottom 0.381: T1.3 6.35,113.03 DF0.B
N$2
  Bottom 0.381: T2.3 19.68,114.3 20.32,113.67 20.32,109.22 DF1.B
N$3
  Bottom 0.381: T3.3 34.92,113.03 DF2.B
N$4
  Bottom 0.381: T4.3 48.26,114.3 48.9,113.67 48.9,109.22 IF0.B
N$5
  Bottom 0.381: T5.3 63.5,113.03 IF1.B
N$6
  Top 0.381: T6.3 79.38,114.3 79.38,109.22 78.11,109.22 IF2.B
N$7
  Bottom 0.381: T7.3 92.08,113.03 PC0.B
N$8
  Bottom 0.381: T8.3 105.41,114.3 106.05,113.67 106.05,109.22 PC1.B
N$9
  Bottom 0.381: T9.3 120.65,113.03 PC2.B
N$10
  Bottom 0.381: T10.3 133.99,114.3 134.62,113.67 134.62,109.22 PC3.B
N$11
  Bottom 0.381: T11.3 149.22,113.03 PC4.B
N$12
  Bottom 0.381: T12.3 162.56,114.3 163.19,113.67 163.19,109.22 PC5.B
N$13
  Bottom 0.381: T13.3 177.8,113.03 PC6.B
N$14
  Top 0.381: T14.3 191.13,114.3 191.13,109.22 191.77,109.22 PC7.B
N$15
  Bottom 0.381: T15.3 206.38,113.03 PC8.B
N$16
  Top 0.381: T16.3 219.71,114.3 219.71,109.22 220.34,109.22 PC9.B
N$17
  Bottom 0.381: T17.3 234.95,113.03 PC10.B
N$18
  Bottom 0.381: T18.3 248.28,114.3 248.92,113.67 248.92,109.22 PC11.B
N$19
  Bottom 0.381: T19.3 92.08,90.81 MA0.B
N$20
  Bottom 0.381: T20.3 105.41,92.08 106.05,91.44 106.05,87 MA1.B
N$21
  Bottom 0.381: T21.3 120.65,90.81 MA2.B
N$22
  Bottom 0.381: T22.3 133.99,92.08 134.62,91.44 134.62,87 MA3.B
N$23
  Bottom 0.381: T23.3 149.22,90.81 MA4.B
N$24
  Bottom 0.381: T24.3 162.56,92.08 163.19,91.44 163.19,87 MA5.B
N$25
  Bottom 0.381: T25.3 177.8,90.81 MA6.B
N$26
  Bottom 0.381: T26.3 191.13,92.08 191.77,91.44 191.77,87 MA7.B
N$27
  Bottom 0.381: T27.3 206.38,90.81 MA8.B
N$28
  Bottom 0.381: T28.3 219.71,92.08 220.34,91.44 220.34,87 MA9.B
N$29
  Bottom 0.381: T29.3 234.95,90.81 MA10.B
N$30
  Bottom 0.381: T30.3 248.28,92.08 248.92,91.44 248.92,87 MA11.B
N$31
  Bottom 0.381: T31.3 92.08,68.58 MB0.B
N$32
  Bottom 0.381: T32.3 105.41,69.85 106.05,69.22 106.05,64.77 MB1.B
N$33
  Bottom 0.381: T33.3 120.65,68.58 MB2.B
N$34
  Bottom 0.381: T34.3 133.99,69.85 134.62,69.22 134.62,64.77 MB3.B
N$35
  Bottom 0.381: T35.3 149.22,68.58 MB4.B
N$36
  Bottom 0.381: T36.3 162.56,69.85 163.19,69.22 163.19,64.77 MB5.B
N$37
  Top 0.381: T37.3 176.53,64.77 177.8,64.77 MB6.B
N$38
  Bottom 0.381: T38.3 191.13,69.85 191.77,69.22 191.77,64.77 MB7.B
N$39
  Bottom 0.381: T39.3 206.38,68.58 MB8.B
N$40
  Bottom 0.381: T40.3 219.71,69.85 220.34,69.22 220.34,64.77 MB9.B
N$41
  Bottom 0.381: T41.3 234.95,68.58 MB10.B
N$42
  Bottom 0.381: T42.3 248.28,69.85 248.92,69.22 248.92,64.77 MB11.B
N$43
  Bottom 0.381: T43.3 90.81,43.81 92.08,42.55 AC0.B
N$44
  Bottom 0.381: T44.3 105.41,47.62 106.05,46.99 106.05,42.55 AC1.B
N$45
  Bottom 0.381: T45.3 120.65,46.35 AC2.B
N$46
  Bottom 0.381: T46.3 133.99,47.62 134.62,46.99 134.62,42.55 AC3.B
N$47
  Bottom 0.381: T47.3 149.22,46.35 AC4.B
N$48
  Bottom 0.381: T48.3 162.56,47.62 163.19,46.99 163.19,42.55 AC5.B
N$49
  Top 0.381: T49.3 176.53,42.55 177.8,42.55 AC6.B
N$50
  Bottom 0.381: T50.3 191.13,47.62 191.77,46.99 191.77,42.55 AC7.B
N$51
  Bottom 0.381: T51.3 206.38,46.35 AC8.B
N$52
  Bottom 0.381: T52.3 219.71,47.62 220.34,46.99 220.34,42.55 AC9.B
N$53
  Bottom 0.381: T53.3 234.95,46.35 AC10.B
N$54
  Bottom 0.381: T54.3 248.92,45.09 248.92,42.55 AC11.B
N$55
  Bottom 0.381: MQ0.B 92.08,23.81 90.81,25.08 T55.3
N$56
  Bottom 0.381: T56.3 106.05,24.45 106.05,20 MQ1.B
N$57
  Bottom 0.381: MQ2.B 120.65,23.81 119.38,25.08 T57.3
N$58
  Bottom 0.381: T58.3 134.62,24.45 134.62,20 MQ3.B
N$59
  Bottom 0.381: MQ4.B 149.22,23.81 147.96,25.08 T59.3
N$60
  Bottom 0.381: T60.3 163.19,24.45 163.19,20 MQ5.B
N$61
  Bottom 0.381: MQ6.B 177.8,23.81 176.53,25.08 T61.3
N$62
  Bottom 0.381: T62.3 191.77,24.45 191.77,20 MQ7.B
N$63
  Bottom 0.381: MQ8.B 206.38,23.81 205.1,25.08 T63.3
N$64
  Bottom 0.381: T64.3 220.34,24.45 220.34,20 MQ9.B
N$65
  Bottom 0.381: T65.3 233.68,21.27 MQ10.B
N$66
  Bottom 0.381: T66.3 248.92,24.45 248.92,20 MQ11.B
N$67
  Bottom 0.381: SC0.B 6.35,23.81 5.08,25.08 T67.3
N$68
  Bottom 0.381: T68.3 20.32,24.45 20.32,20 SC1.B
N$69
  Bottom 0.381: SC2.B 34.92,23.81 33.66,25.08 T69.3
N$70
  Bottom 0.381: T70.3 48.9,24.45 48.9,20 SC3.B
N$71
  Bottom 0.381: SC4.B 63.5,23.81 62.23,25.08 T71.3
N$72
  Bottom 0.381: T72.3 76.83,47.62 77.47,46.99 77.47,42.55 LINK.B
N$73
  Top 0.381: T73.3 357.5,108.58 363.22,108.58 ION.B
N$74
  Top 0.381: PAUSE.B 357.5,97.79 355.6,95.89 T74.3
N$75
  Top 0.381: T75.3 357.5,86.36 363.22,86.36 RUN.B
N$76
  Top 0.381: T76.3 335.28,109.22 FETCH.B
N$77
  Top 0.381: EXECUTE.B 342.9,97.79 T77.3
N$78
  Top 0.381: T78.3 335.28,87 DEFER.B
N$79
  Top 0.381: WORDCOUNT.B 342.9,75.56 T79.3
N$80
  Top 0.381: T80.3 335.28,64.77 CURRENTADDRESS.B
N$81
  Top 0.381: BREAK.B 342.9,53.34 T81.3
N$82
  Top 0.381: T82.3 306.7,109.22 AND.B
N$83
  Top 0.381: TAD.B 314.32,97.79 T83.3
N$84
  Top 0.381: T84.3 306.7,87 ISZ.B
N$85
  Top 0.381: DCA.B 314.32,75.56 T85.3
N$86
  Top 0.381: T86.3 306.7,64.77 JMS.B
N$87
  Top 0.381: JMP.B 314.32,53.34 T87.3
N$88
  Top 0.381: T88.3 306.7,42.55 IOT.B
N$89
  Top 0.381: OPR.B 314.32,31.11 T89.3
N$90
  Top 0.381: DF0.A R1.2
N$91
  Top 0.381: R2.2 20.95,103.5 20.95,106.05 DF1.A
N$92
  Top 0.381: DF2.A R3.2
N$93
  Top 0.381: R4.2 49.53,103.5 49.53,106.05 IF0.A
N$94
  Top 0.381: IF1.A R5.2
N$95
  Top 0.381: R6.2 78.11,103.5 78.11,106.05 IF2.A
N$96
  Top 0.381: PC0.A R7.2
N$97
  Top 0.381: R8.2 106.68,103.5 106.68,106.05 PC1.A
N$98
  Top 0.381: PC2.A R9.2
N$99
  Top 0.381: R10.2 135.25,103.5 135.25,106.05 PC3.A
N$100
  Top 0.381: PC4.A R11.2
N$101
  Top 0.381: R12.2 163.83,103.5 163.83,106.05 PC5.A
N$102
  Top 0.381: PC6.A R13.2
N$103
  Top 0.381: R14.2 192.41,103.5 192.41,106.05 PC7.A
N$104
  Bottom 0.381: PC8.A R15.2
N$105
  Bottom 0.381: R16.2 220.98,103.5 220.98,106.05 PC9.A
N$106
  Top 0.381: PC10.A R17.2
N$107
  Top 0.381: R18.2 249.56,103.5 249.56,106.05 PC11.A
N$108
  Top 0.381: R73.2 363.22,106.05 ION.A
N$109
  Top 0.381: R74.2 363.86,92.08 363.86,95.25 PAUSE.A
N$110
  Top 0.381: R75.2 363.86,81.28 363.86,83.82 RUN.A
N$111
  Top 0.381: MA0.A R19.2
N$112
  Top 0.381: R20.2 106.68,81.28 106.68,83.82 MA1.A
N$113
  Top 0.381: MA2.A R21.2
N$114
  Top 0.381: R22.2 135.25,81.28 135.25,83.82 MA3.A
N$115
  Top 0.381: MA4.A R23.2
N$116
  Top 0.381: R24.2 163.83,81.28 163.83,83.82 MA5.A
N$117
  Top 0.381: MA6.A R25.2
N$118
  Top 0.381: R26.2 192.41,81.28 192.41,83.82 MA7.A
N$119
  Top 0.381: MA8.A R27.2
N$120
  Top 0.381: R28.2 220.98,81.28 220.98,83.82 MA9.A
N$121
  Top 0.381: MA10.A R29.2
N$122
  Top 0.381: R30.2 249.56,81.28 249.56,83.82 MA11.A
N$123
  Top 0.381: R76.2 335.28,103.5 335.28,106.05 FETCH.A
N$124
  Top 0.381: R77.2 335.28,92.08 335.28,95.25 EXECUTE.A
N$125
  Top 0.381: R78.2 335.28,81.28 335.28,83.82 DEFER.A
N$126
  Top 0.381: R79.2 335.28,69.85 335.28,73.03 WORDCOUNT.A
N$127
  Top 0.381: R80.2 335.28,59.05 335.28,61.59 CURRENTADDRESS.A
N$128
  Top 0.381: R81.2 335.28,47.62 335.28,50.8 BREAK.A
N$129
  Top 0.381: R72.2 78.11,36.83 78.11,39.37 LINK.A
N$130
  Top 0.381: MB0.A R31.2
N$131
  Top 0.381: R32.2 106.68,59.05 106.68,61.59 MB1.A
N$132
  Top 0.381: MB2.A R33.2
N$133
  Top 0.381: R34.2 135.25,59.05 135.25,61.59 MB3.A
N$134
  Top 0.381: MB4.A R35.2
N$135
  Top 0.381: R36.2 163.83,59.05 163.83,61.59 MB5.A
N$136
  Top 0.381: MB6.A R37.2
N$137
  Top 0.381: R38.2 192.41,59.05 192.41,61.59 MB7.A
N$138
  Top 0.381: MB8.A R39.2
N$139
  Top 0.381: R40.2 220.98,59.05 220.98,61.59 MB9.A
N$140
  Top 0.381: MB10.A R41.2
N$141
  Top 0.381: R42.2 249.56,59.05 249.56,61.59 MB11.A
N$142
  Top 0.381: AC0.A R43.2
N$143
  Top 0.381: R44.2 106.68,36.83 106.68,39.37 AC1.A
N$144
  Top 0.381: AC2.A R45.2
N$145
  Top 0.381: R46.2 135.25,36.83 135.25,39.37 AC3.A
N$146
  Top 0.381: AC4.A R47.2
N$147
  Top 0.381: R48.2 163.83,36.83 163.83,39.37 AC5.A
N$148
  Top 0.381: AC6.A R49.2
N$149
  Top 0.381: R50.2 192.41,36.83 192.41,39.37 AC7.A
N$150
  Top 0.381: AC8.A R51.2
N$151
  Top 0.381: R52.2 220.98,36.83 220.98,39.37 AC9.A
N$152
  Top 0.381: AC10.A R53.2
N$153
  Top 0.381: R54.2 249.56,36.83 249.56,39.37 AC11.A
N$154
  Top 0.381: SC0.A R67.2
N$155
  Top 0.381: R68.2 20.95,14.29 20.95,17.46 SC1.A
N$156
  Top 0.381: SC2.A R69.2
N$157
  Top 0.381: R70.2 49.53,14.29 49.53,17.46 SC3.A
N$158
  Top 0.381: SC4.A R71.2
N$159
  Top 0.381: R66.2 249.56,14.29 249.56,17.46 MQ11.A
N$160
  Top 0.381: MQ10.A R65.2
N$161
  Top 0.381: R64.2 220.98,14.29 220.98,17.46 MQ9.A
N$162
  Top 0.381: MQ8.A R63.2
N$163
  Top 0.381: R62.2 192.41,14.29 192.41,17.46 MQ7.A
N$164
  Top 0.381: MQ6.A R61.2
N$165
  Top 0.381: R60.2 163.83,14.29 163.83,17.46 MQ5.A
N$166
  Top 0.381: MQ4.A R59.2
N$167
  Top 0.381: R58.2 135.25,14.29 135.25,17.46 MQ3.A
N$168
  Top 0.381: MQ2.A R57.2
N$169
  Top 0.381: R56.2 106.68,14.29 106.68,17.46 MQ1.A
N$170
  Top 0.381: MQ0.A R55.2
N$171
  Top 0.381: R82.2 306.7,103.5 306.7,106.05 AND.A
N$172
  Top 0.381: R83.2 306.7,92.08 306.7,95.25 TAD.A
N$173
  Top 0.381: R84.2 306.7,81.28 306.7,83.82 ISZ.A
N$174
  Top 0.381: R85.2 306.7,69.85 306.7,73.03 DCA.A
N$175
  Top 0.381: R86.2 306.7,59.05 306.7,61.59 JMS.A
N$176
  Top 0.381: R87.2 306.7,47.62 306.7,50.8 JMP.A
N$177
  Top 0.381: R88.2 306.7,36.83 306.7,39.37 IOT.A
N$178
  Top 0.381: R89.2 306.7,25.4 306.7,28.57 OPR.A
OPR
  Top 0.381: F40BOT.11 330.2,126.36 328.3,126.36 326.39,124.46 326.39,121.28 327.66,121.28 D40.16
  Bottom 0.381: T89.2 316.23,29.84 315.6,29.21 315.6,28.57 314.32,27.3 311.15,27.3 311.15,117.47 313.69,120.02 313.69,124.46 315.6,126.36 325.75,126.36 325.75,125.09 326.39,124.46 326.39,122.56 327.66,121.28 D40.16
PAUSE
  Bottom 0.381: T74.2 353.69,97.16 349.88,100.97 349.88,110.49 349.25,111.12 349.25,121.92 347.98,123.19 D40.31 347.98,125.09 343.54,125.09 340.36,128.27 340.36,129.54 F40TOP.17
PC0
  Bottom 0.381: D40TOP.1 109.86,130.18 95.89,116.2 T7.2 90.81,116.2 89.53,114.94 89.53,82.55 92.71,82.55 95.89,85.72 95.89,112.39 106.68,123.19 E40.1
PC1
  Top 0.381: T8.2 106.68,116.2 108.58,118.11 114.3,118.11 116.84,120.65 E40.10 116.84,121.28 115.57,121.28 115.57,124.46 116.2,125.09 117.47,125.09 119.38,127 120.65,127 D40BOT.5
PC2
  Bottom 0.381: T9.2 120.65,121.92 119.38,123.19 E40.11 119.38,123.83 121.92,126.36 121.92,130.18 D40TOP.6
PC3
  Top 0.381: T10.2 134.62,116.2 E40.24 134.62,121.28 133.35,122.56 133.35,124.46 135.25,125.73 135.25,130.18 D40BOT.14
PC4
  Bottom 0.381: D40TOP.14 135.25,130.18 135.25,125.73 137.16,123.83 E40.25 137.16,123.19 138.43,121.92 138.43,120.02 142.24,116.2 T11.2
PC5
  Top 0.381: T12.2 163.19,116.2 160.02,119.38 154.62,119.38 153.35,120.65 147.32,120.65 E40.34 147.32,121.6 146.05,122.87 146.05,125.41 144.46,125.41 142.88,127 D40BOT.19
PC6
  Top 0.381: T13.2 184.78,123.19 195.58,123.19 F40.1
  Bottom 0.381: E40TOP.1 195.58,125.73 F40.1
PC7
  Top 0.381: T14.2 192.41,116.2 194.31,118.11 203.2,118.11 205.74,120.65 F40.10 205.74,121.28 207.01,122.56 207.01,125.73 206.38,126.36 E40BOT.5
PC8
  Bottom 0.381: T15.2 207.01,116.84 207.01,121.92 208.28,123.19 F40.11 208.28,130.18 E40TOP.6
PC9
  Top 0.381: E40BOT.14 220.98,130.18 220.98,125.41 219.71,124.46 219.71,122.24 222.57,122.24 F40.24
  Bottom 0.381: F40.24 223.52,118.75 220.98,116.2 T16.2
PC10
  Top 0.381: F40.25 226.06,122.87 227.33,121.6 227.33,120.02 230.5,116.84 234.31,116.84 T17.2
  Bottom 0.381: E40TOP.14 220.98,130.18 220.98,128.27 226.06,123.19 F40.25
PC11
  Top 0.381: E40BOT.19 233.68,125.09 234.95,125.09 234.95,122.87 236.22,121.6 F40.34
  Bottom 0.381: T18.2 240.66,116.2 236.22,120.65 F40.34
RUN
  Bottom 0.381: T75.2 358.77,85.72 358.77,114.94 350.52,123.19 D40.33 350.52,126.36 343.54,126.36 341.63,128.27 341.63,130.18 F40TOP.18
SC0
  Bottom 0.381: T67.2 6.35,27.62 32.38,52.07 32.38,119.38 33.02,120.02 33.02,121.92 34.29,123.19 C40.9 34.29,129.54 C40TOP.5
SC1
  Top 0.381: T68.2 3.81,42.55 3.81,130.18 25.4,130.18 | C40BOT.1 25.4,130.18 | 25.4,130.18 25.4,122.56 24.13,121.28 C40.2
SC2
  Bottom 0.381: T69.2 34.92,27.62 53.34,44.45 53.34,121.92 52.07,123.19 C40.23 52.07,123.83 48.26,127.64 48.26,129.54 C40TOP.13
SC3
  Top 0.381: C40BOT.6 36.83,130.18 36.83,125.09 37.47,125.09 38.1,124.46 38.1,121.28 36.83,121.28 C40.12
  Bottom 0.381: T70.2 48.9,26.99 36.2,26.99 34.92,25.72 33.66,26.99 33.66,100.33 37.47,104.14 37.47,120.02 36.83,120.65 C40.12
SC4
  Bottom 0.381: 55.88,125.09 55.88,130.18 C40TOP.18 | 55.88,125.09 55.88,33.66 63.5,27.62 T71.2 | 55.88,125.09 63.5,125.09 64.77,123.83 C40.33
TAD
  Top 0.381: F40BOT.2 315.6,130.18 315.6,125.09 314.32,125.09 313.69,124.46 313.69,121.28 312.42,121.28 D40.4
  Bottom 0.381: T83.2 316.23,97.16 317.5,98.42 317.5,118.75 316.23,120.02 316.23,124.46 316.87,125.09 323.85,125.09 323.85,120.02 324.49,119.38 328.93,119.38 328.93,124.46 325.75,127.64 311.15,127.64 311.15,122.56 312.42,121.28 D40.4
WC
  Top 0.381: F40BOT.17 339.73,127.64 342.26,125.09 343.54,125.09 344.17,124.46 344.17,121.28 345.44,121.28 D40.30
  Bottom 0.381: D40.30 345.44,113.67 348.62,110.49 348.62,78.74 344.81,74.93 T79.2

## Text on the board
Bottom: PDP-8/I Light Board 50045108 | 5404519